# EAGLE design ESPHome 4-switch (EAGLE 9.6.2)
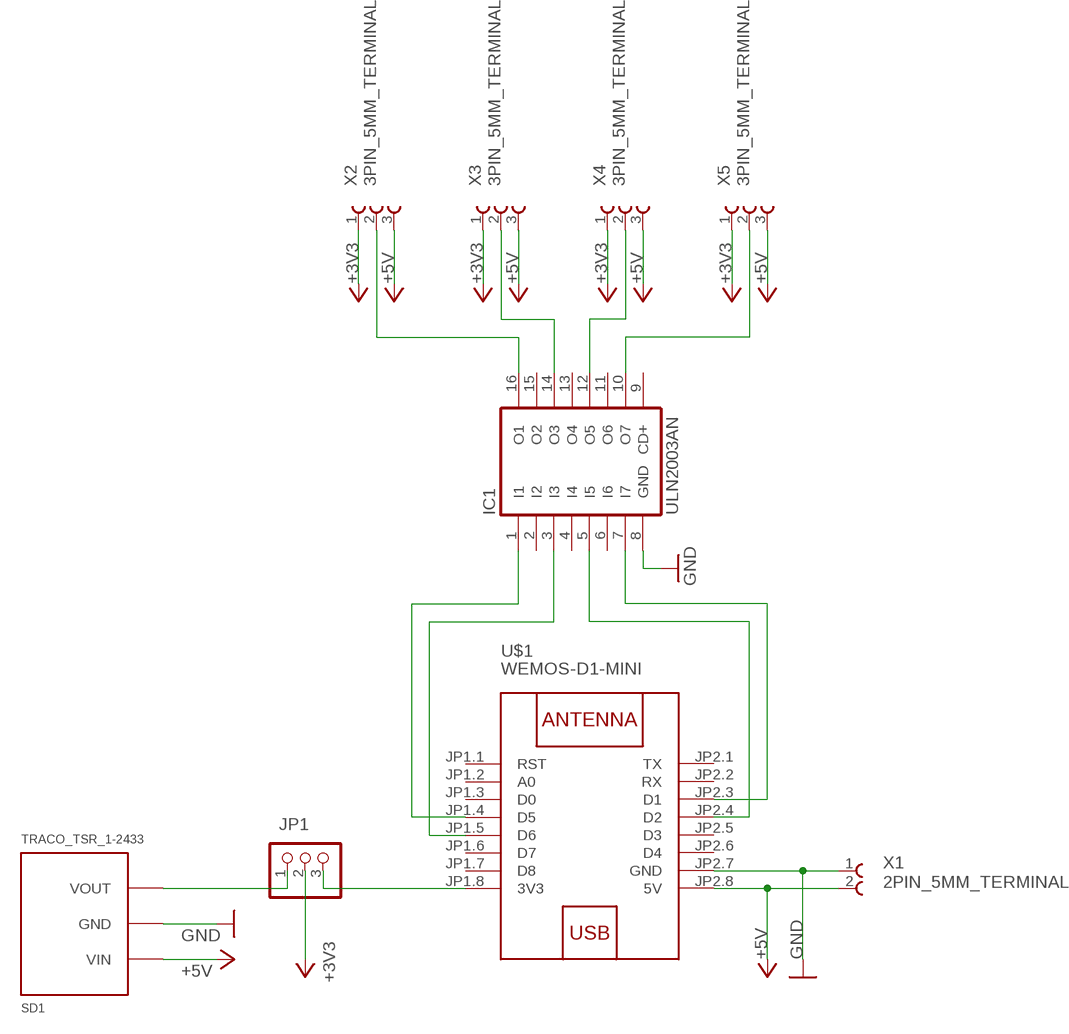
[diagram p0: schematic, sheet 1]

## Parts
IC1  ULN2003AN  [DIL16]
JP1  PINHD-1X3  [1X03]
SD1  TRACO_TSR_1-2433  [TRACO_TSR_1-24XX]
U$1  WEMOS-D1-MINI  [WEMOS-D1-MINI]
X1  2PIN_5MM_TERMINAL  [2PIN_5MM_TERMMINAL]
X2  3PIN_5MM_TERMINAL  [3PIN_5MM_TERMINAL]
X3  3PIN_5MM_TERMINAL  [3PIN_5MM_TERMINAL]
X4  3PIN_5MM_TERMINAL  [3PIN_5MM_TERMINAL]
X5  3PIN_5MM_TERMINAL  [3PIN_5MM_TERMINAL]

## Nets
+3V3: JP1.2 X2.1 X3.1 X4.1 X5.1
+5V: SD1.VIN U$1.JP2.8(5V) X1.2 X2.3 X3.3 X4.3 X5.3
GND: IC1.8(GND) SD1.GND U$1.JP2.7(GND) X1.1
N$1: JP1.1 SD1.VOUT
N$2: JP1.3 U$1.JP1.8(3V3)
N$3: IC1.5(I5) U$1.JP2.4(D2)
N$4: IC1.7(I7) U$1.JP2.3(D1)
N$5: IC1.3(I3) U$1.JP1.5(D6)
N$6: IC1.1(I1) U$1.JP1.4(D5)
N$7: IC1.16(O1) X2.2
N$8: IC1.14(O3) X3.2
N$9: IC1.12(O5) X4.2
N$10: IC1.10(O7) X5.2
Unconnected: IC1.2(I2) IC1.4(I4) IC1.6(I6) IC1.9(CD+) IC1.11(O6) IC1.13(O4) IC1.15(O2) U$1.JP1.1(RST) U$1.JP1.2(A0) U$1.JP1.3(D0) U$1.JP1.6(D7) U$1.JP1.7(D8) U$1.JP2.1(TX) U$1.JP2.2(RX) U$1.JP2.5(D3) U$1.JP2.6(D4)

## Library data of the parts
IC1 = ULN:ULN2003A: DRIVER ARRAY
JP1 = Headery:PINHD-1X3: PIN HEADER
SD1 = Voltage:TRACO_TSR_1-2433
U$1 = Sbirka modulu:WEMOS-D1-MINI: WEMOS D1 mini: Mini Wi-Fi Board based on ESP-8266 device More details can be found here: https://www.wemos.cc/product/d1-mini.html Click here to find device on ebay.com <http://www.ebay.com/sch/wemos+d1+mini+nodemcu>
X1 = Terminaly:2PIN_5MM_TERMINAL
X2-X5 = Terminaly:3PIN_5MM_TERMINAL

## Board
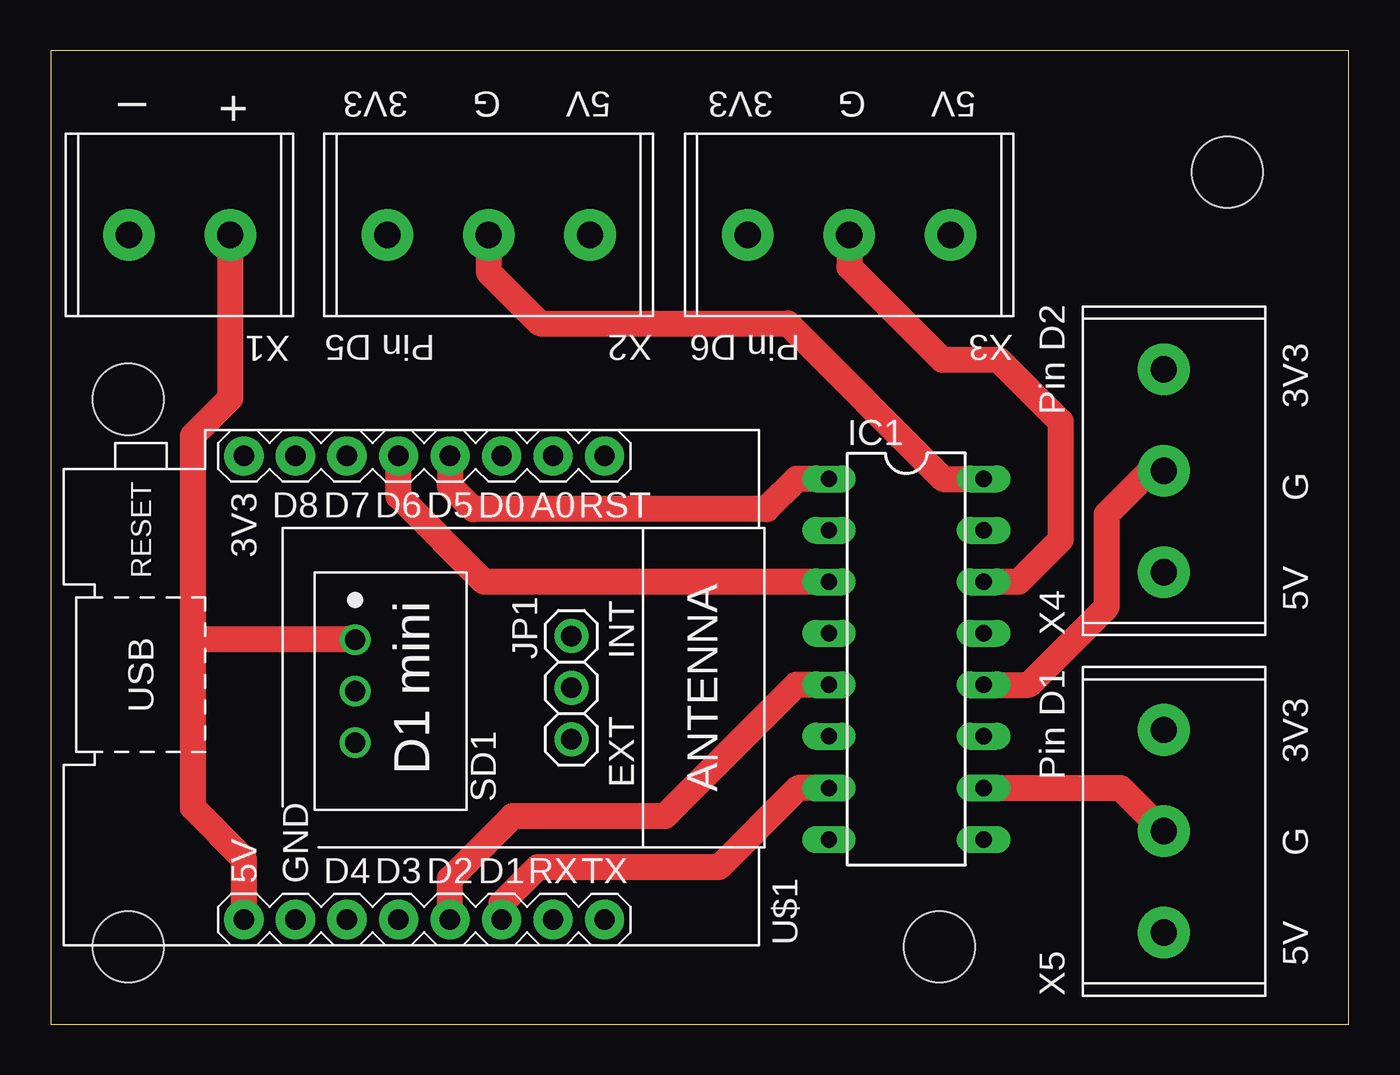
[diagram p1: board, top side]
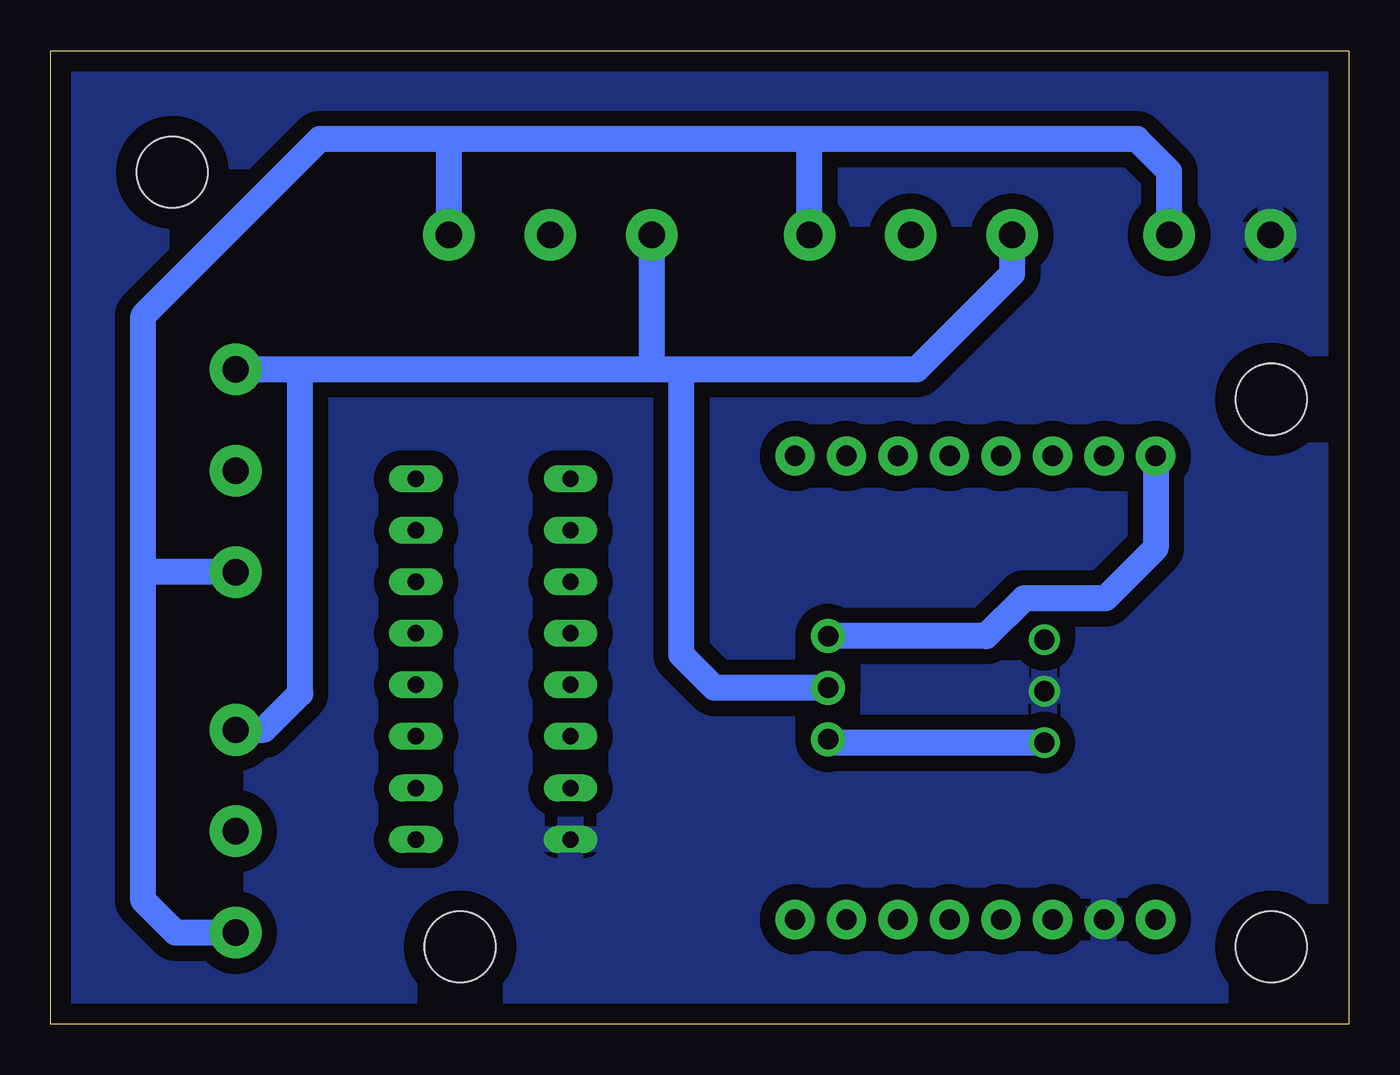
[diagram p2: board, bottom side, seen from below]

Size 64 x 48 mm. Coordinates in mm from the lower left corner, seen from the top.
Outline: 0,0 64,0 64,48 0,48 0,0
Copper layers (1*16): Top 0.035mm / dielectric 1.5mm / Bottom 0.035mm
Design rules "default *": minimum track width 20mil, minimum drill 0.35mm, track to track 30mil, track to pad 20mil, pad to pad 20mil, via to via 30mil, smd to smd 20mil, copper to edge 40mil, drill to drill 40mil, minimum pad ring 10mil, minimum via ring 8mil, stop-mask expansion 4mil, vias tented up to drill 0mil, thermal gap 10mil
Holes 3.5 mm at 3.81,3.81 43.81,3.81 58,42 3.81,30.81

### Footprints (pad centres in the part's own frame; a part is rotated, then mirrored left to right if it is on the bottom)
DIL16 = drill 0.813 long: 1 -8.89,-3.81; 2 -6.35,-3.81; 3 -3.81,-3.81; 4 -1.27,-3.81; 5 1.27,-3.81; 6 3.81,-3.81; 7 6.35,-3.81; 8 8.89,-3.81; 9 8.89,3.81; 10 6.35,3.81; 11 3.81,3.81; 12 1.27,3.81; 13 -1.27,3.81; 14 -3.81,3.81; 15 -6.35,3.81; 16 -8.89,3.81
1X03 = drill 1.016 pad 1.676: 1 -2.54,0; 2 0,0; 3 2.54,0
TRACO_TSR_1-24XX = drill 1: GND -0.01,-1.75; VIN -2.55,-1.75; VOUT 2.53,-1.75
WEMOS-D1-MINI = drill 1 pad 1.93: JP1.1 -11.43,9.525; JP1.2 -11.43,6.985; JP1.3 -11.43,4.445; JP1.4 -11.43,1.905; JP1.5 -11.43,-0.635; JP1.6 -11.43,-3.175; JP1.7 -11.43,-5.715; JP1.8 -11.43,-8.255; JP2.1 11.43,9.525; JP2.2 11.43,6.985; JP2.3 11.43,4.445; JP2.4 11.43,1.905; JP2.5 11.43,-0.635; JP2.6 11.43,-3.175; JP2.7 11.43,-5.715; JP2.8 11.43,-8.255
2PIN_5MM_TERMMINAL = drill 1.3 pad 2.54: 1 -2.5,0; 2 2.5,0
3PIN_5MM_TERMINAL = drill 1.3 pad 2.54: 1 -5,0; 2 0,0; 3 5,0

### Placement (x,y rotation side)
IC1  42.18,18 270 top
JP1  25.67,16.59 90 top
SD1  16.76,16.41 270 top
U$1  17.78,16.59 270 top
X1  6.35,38.91 0 top
X2  21.59,38.91 0 top
X3  39.37,38.91 0 top
X4  54.88,27.29 270 top
X5  54.88,9.51 270 top

### Tracks (layer width: path | path; a pad name or v marks a point on that pad's centre or on a via)
+3V3
  Bottom 1.27: X2.1 16.59,37 21.3,32.29 32.9,32.29 | JP1.2 31.28,16.59 32.9,18.21 32.9,32.29 | X4.1 51.7,32.29 | 51.7,32.29 34.3,32.29 | 34.3,32.29 32.9,32.29 | X3.1 34.37,32.36 34.3,32.29 | X5.1 53.49,14.51 51.7,16.3 51.7,32.29
+5V
  Top 1.27: X1.2 8.85,30.85 7,29 7,19 | 7,19 7,10.69 9.53,8.16 U$1.JP2.8 | SD1.VIN 7.04,18.96 7,19
  Bottom 1.27: 59.44,22.1 59.44,6.1 57.85,4.51 X5.3 | 59.44,22.1 59.44,34.94 50.73,43.64 44.45,43.64 | X1.2 8.85,42.05 10.45,43.64 26.92,43.64 | 26.92,43.64 44.45,43.64 | X4.3 59.24,22.29 59.44,22.1 | X3.3 44.37,43.56 44.45,43.64 | X2.3 26.59,43.31 26.92,43.64
GND
  pour Bottom: 1,47 1,1 2,1 63,1 63,47
N$1
  Bottom 1.27: SD1.VOUT 25.5,13.88 JP1.1
N$2
  Bottom 1.27: U$1.JP1.8 9.53,23.48 12,21 16,21 17.87,19.13 JP1.3
N$3
  Top 1.27: U$1.JP2.4 19.68,7.18 22.76,10.25 30.27,10.25 36.75,16.73 IC1.5
N$4
  Top 1.27: U$1.JP2.3 22.23,5.96 24.01,7.74 32.94,7.74 36.85,11.65 IC1.7
N$5
  Top 1.27: U$1.JP1.5 17.14,26.04 21.37,21.81 IC1.3
N$6
  Top 1.27: U$1.JP1.4 19.68,26.54 20.83,25.4 35.3,25.4 36.79,26.89 IC1.1
N$7
  Top 1.27: X2.2 21.59,37.08 24.13,34.54 36.35,34.54 44,26.89 IC1.16
N$8
  Top 1.27: X3.2 39.37,37.34 43.94,32.77 46.74,32.77 49.78,29.72 49.78,23.88 47.72,21.81 IC1.14
N$9
  Top 1.27: X4.2 54.21,27.29 52.07,25.15 52.07,20.57 48.23,16.73 IC1.12
N$10
  Top 1.27: IC1.10 52.74,11.65 X5.2

### Text on the board
tNames: – | + | 3V3 | G | 5V | 3V3 | G | 5V | Pin D2 | Pin D5 | Pin D6 | 3V3 | G | 5V | INT | Pin D1 | EXT | 3V3 | G | 5V